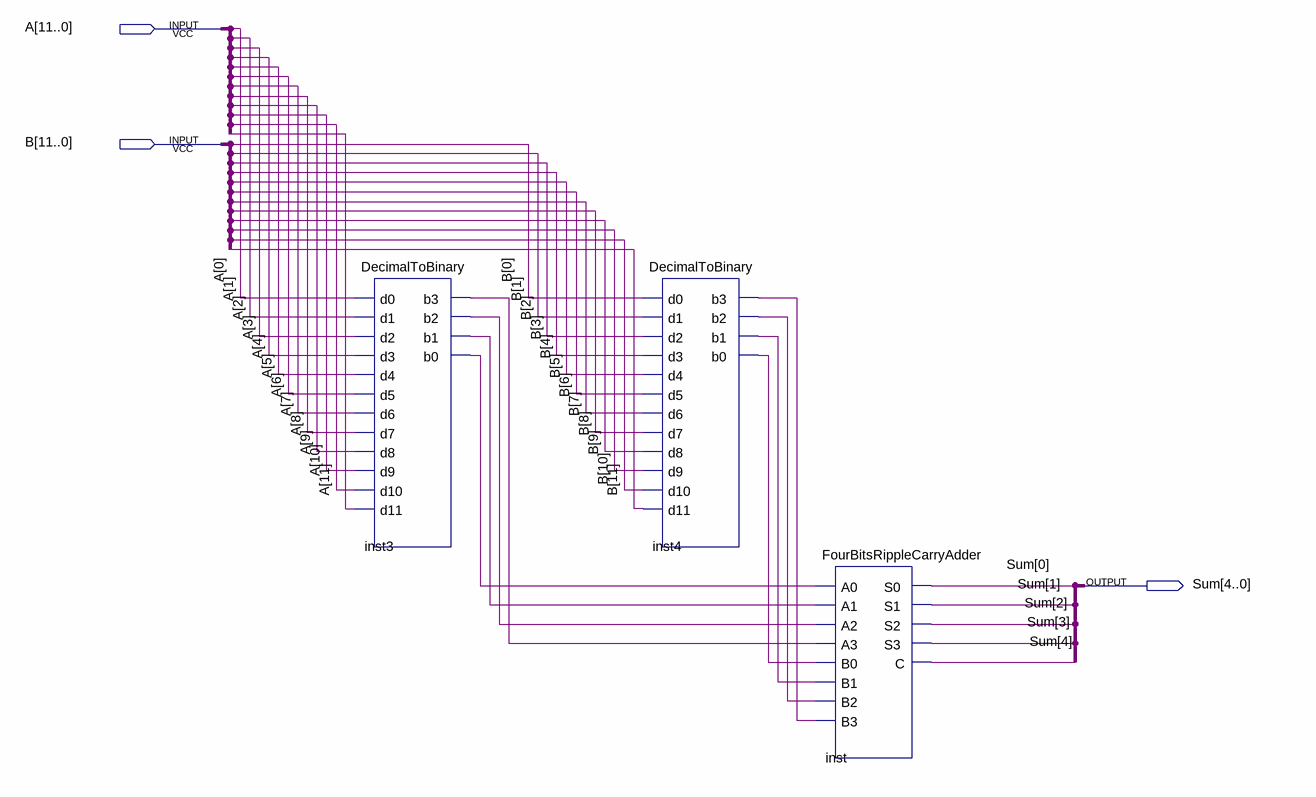
[diagram p0: schematic sheet]
// Quartus schematic Adder.bdf as structural Verilog: 3 symbols, 3 pins
module Adder (
  input  [11:0] A,
  input  [11:0] B,
  output [4:0] Sum
);

  wire inst3_b0, inst3_b1, inst3_b2, inst3_b3, inst4_b0, inst4_b1, inst4_b2, inst4_b3;

  DecimalToBinary inst3 (
    .d0(A[0]), .d1(A[1]), .d2(A[2]), .d3(A[3]), .d4(A[4]), .d5(A[5]), .d6(A[6]), .d7(A[7]), .d8(A[8]),
    .d9(A[9]), .d10(A[10]), .d11(A[11]), .b3(inst3_b3), .b2(inst3_b2), .b1(inst3_b1), .b0(inst3_b0));
  DecimalToBinary inst4 (
    .d0(B[0]), .d1(B[1]), .d2(B[2]), .d3(B[3]), .d4(B[4]), .d5(B[5]), .d6(B[6]), .d7(B[7]), .d8(B[8]),
    .d9(B[9]), .d10(B[10]), .d11(B[11]), .b3(inst4_b3), .b2(inst4_b2), .b1(inst4_b1), .b0(inst4_b0));
  FourBitsRippleCarryAdder inst (
    .A0(inst3_b0), .A1(inst3_b1), .A2(inst3_b2), .A3(inst3_b3), .B0(inst4_b0), .B1(inst4_b1), .B2(inst4_b2),
    .B3(inst4_b3), .S0(Sum[0]), .S1(Sum[1]), .S2(Sum[2]), .S3(Sum[3]), .C(Sum[4]));
endmodule
